# EAGLE design 7segement4digits1badidea-feathershield-mk-1.0 (EAGLE 7.5.0)
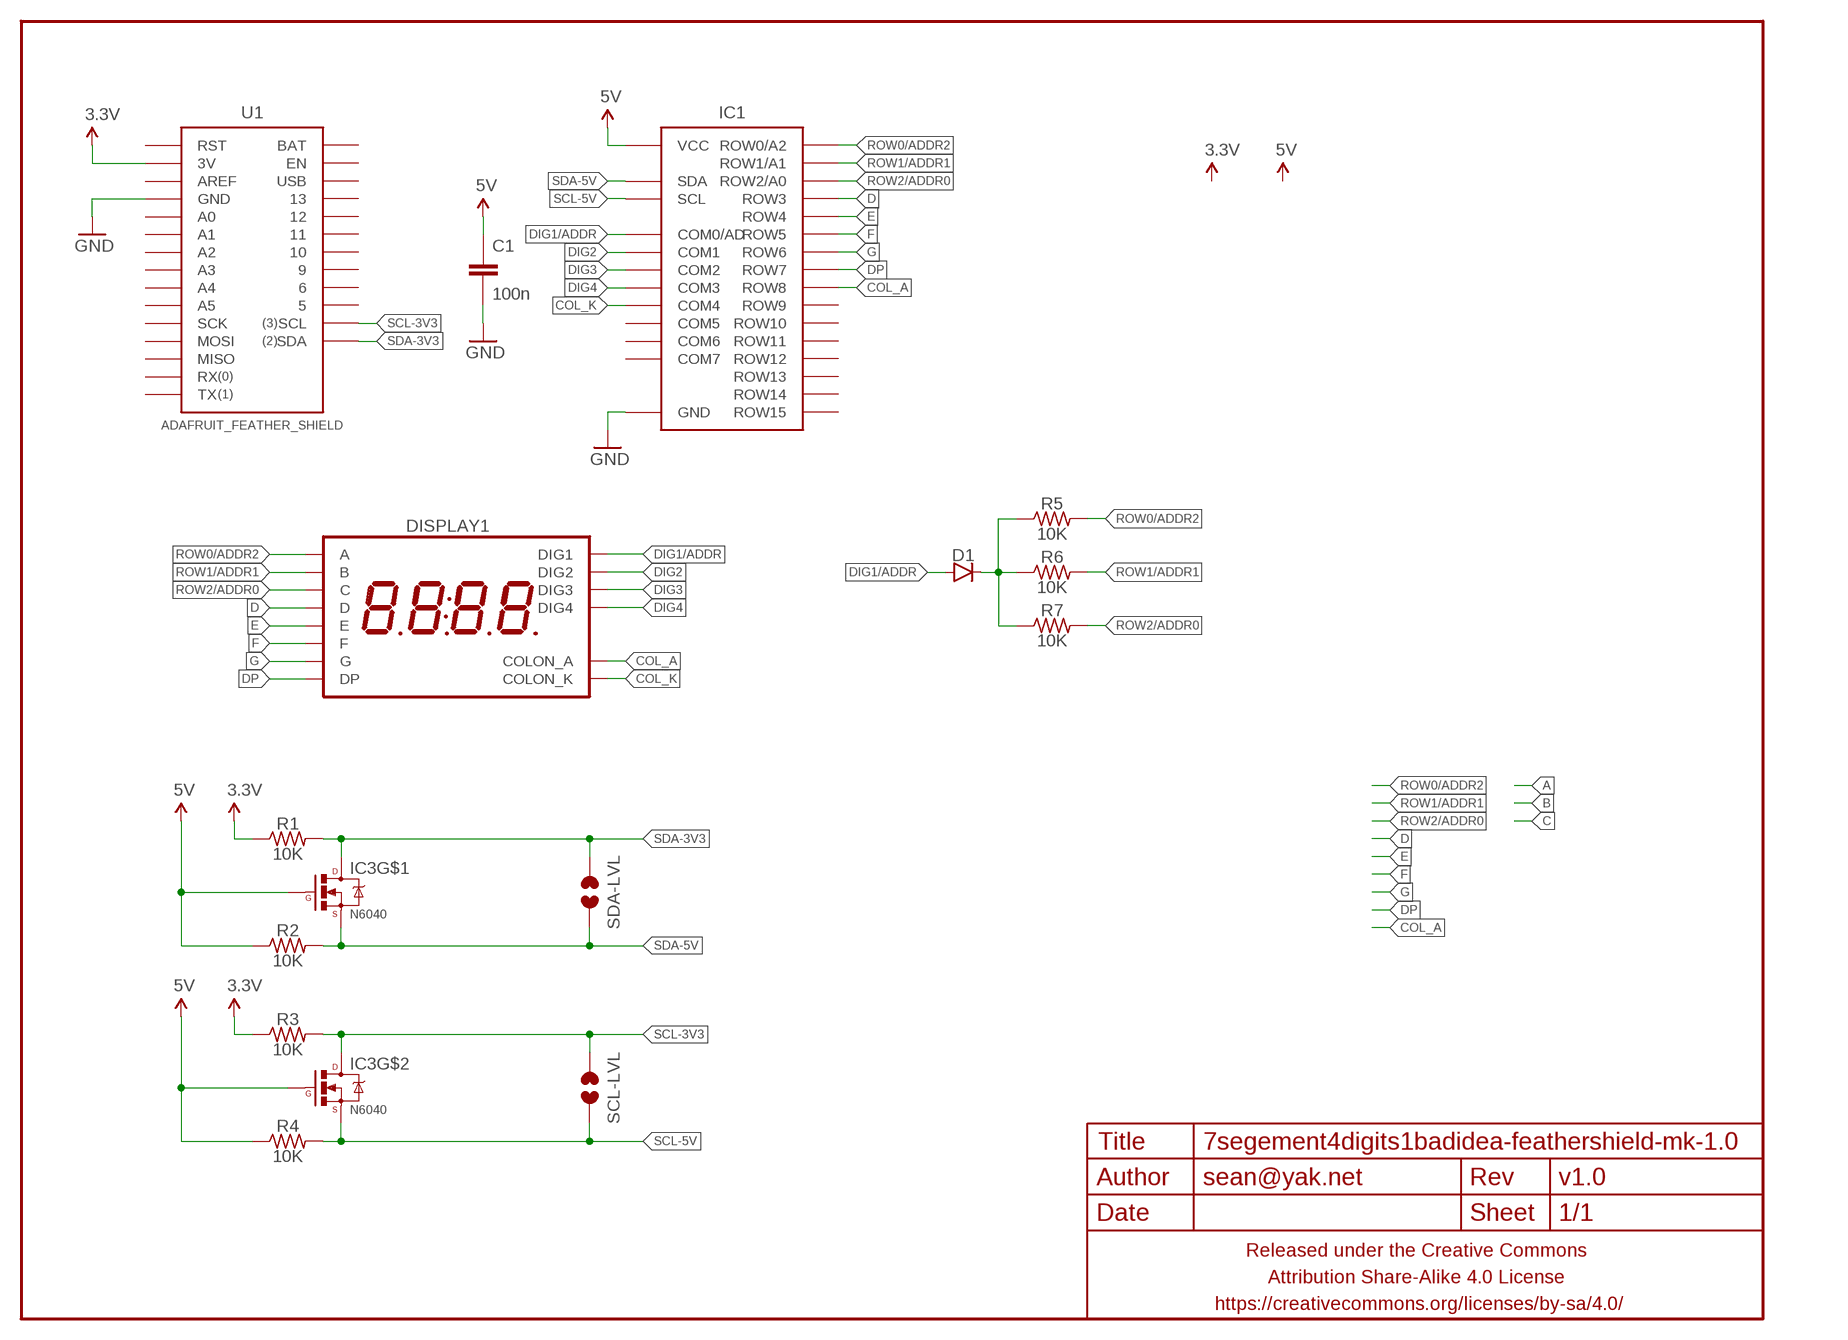
[diagram p0: schematic, sheet 1]

## Parts
C1  100n  CAPACITOR-CERAMICC0603  [C0603]
D1  DIODESOT23  [SOT23]
DISPLAY1  7SEG_4DIGIT_COLON14.2MM-CC  [7SEG_4DIG_0.56IN_14MM_ADAFRUIT]
FRAME1  FRAME-LETTERNO_PACKAGE  [DUMMY]
IC1  HT16K33  HT16K33-28SOIC28W  [SOIC28W]
IC3  N6040  MOSFET-NCHANNEL-DUALSOIC8  [SO08]
R1  10K  RESISTORR0603  [R0603]
R2  10K  RESISTORR0603  [R0603]
R3  10K  RESISTORR0603  [R0603]
R4  10K  RESISTORR0603  [R0603]
R5  10K  RESISTORR0603  [R0603]
R6  10K  RESISTORR0603  [R0603]
R7  10K  RESISTORR0603  [R0603]
SCL-LVL  JUMPER-PAD-2-NOYES_SILK  [PAD-JUMPER-2-NO_YES_SILK]
SDA-LVL  JUMPER-PAD-2-NOYES_SILK  [PAD-JUMPER-2-NO_YES_SILK]
U1  ADAFRUIT_FEATHER_SHIELD  [ADAFRUIT_FEATHER]

## Nets
3.3V: R1.1 R3.1 U1.3V
5V: C1.1 IC1.28(VCC) IC3.2(G) IC3.4(G) R2.1 R4.1
COL_A: DISPLAY1.P$8(COLON_A) IC1.17(ROW8)
COL_K: DISPLAY1.P$7(COLON_K) IC1.6(COM4)
D: DISPLAY1.P$2(D) IC1.22(ROW3)
DIG1/ADDR: D1.1(A) DISPLAY1.P$14(DIG1) IC1.2(COM0/AD)
DIG2: DISPLAY1.P$11(DIG2) IC1.3(COM1)
DIG3: DISPLAY1.P$10(DIG3) IC1.4(COM2)
DIG4: DISPLAY1.P$6(DIG4) IC1.5(COM3)
DP: DISPLAY1.P$3(DP) IC1.18(ROW7)
E: DISPLAY1.P$1(E) IC1.21(ROW4)
F: DISPLAY1.P$12(F) IC1.20(ROW5)
G: DISPLAY1.P$5(G) IC1.19(ROW6)
GND: C1.2 IC1.1(GND) U1.GND@0(GND) U1.GND@1(GND)
N$1: D1.3(C) R5.1 R6.1 R7.1
ROW0/ADDR2: DISPLAY1.P$13(A) IC1.25(ROW0/A2) R5.2
ROW1/ADDR1: DISPLAY1.P$9(B) IC1.24(ROW1/A1) R6.2
ROW2/ADDR0: DISPLAY1.P$4(C) IC1.23(ROW2/A0) R7.2
SCL-3V3: IC3.5(D) IC3.6(D) R3.2 SCL-LVL.1 U1.SCL
SCL-5V: IC1.26(SCL) IC3.3(S) R4.2 SCL-LVL.2
SDA-3V3: IC3.7(D) IC3.8(D) R1.2 SDA-LVL.1 U1.SDA
SDA-5V: IC1.27(SDA) IC3.1(S) R2.2 SDA-LVL.2
Unconnected: IC1.7(COM5) IC1.8(COM6) IC1.9(COM7) IC1.10(ROW15) IC1.11(ROW14) IC1.12(ROW13) IC1.13(ROW12) IC1.14(ROW11) IC1.15(ROW10) IC1.16(ROW9) U1.5 U1.6 U1.9 U1.10 U1.11 U1.12 U1.13 U1.A0 U1.A1 U1.A2 U1.A3 U1.A4 U1.A5 U1.AREF U1.BAT U1.EN U1.MISO U1.MOSI U1.RST U1.RX U1.SCK U1.TX U1.USB

## Library data of the parts
C1 = A_butts:CAPACITOR-CERAMIC: CAPACITOR, European symbol
D1 = a_parts:DIODE: Diode These are standard reverse protection diodes and small signal diodes. SMA package can handle up to about 1A. SOD-323 can handle about 200mA. What the SOD-323 package when ordering, there are some mfgs out there that are 5-pin packages.
DISPLAY1 = a_parts:7SEG_4DIGIT_COLON
FRAME1 = A_butts:FRAME-LETTER: Schematic Frame Standard 8.5x11 US Letter frame; DESIGNER: sean@yak.net; VERSION: v1.0
IC1 = a_parts:HT16K33-28
IC3 = a_parts:MOSFET-NCHANNEL-DUAL
R1-R7 = a_parts:RESISTOR: RESISTOR, American symbol
SCL-LVL SDA-LVL = a_parts:JUMPER-PAD-2-NO
U1 = a_parts:ADAFRUIT_FEATHER_SHIELD

## Board
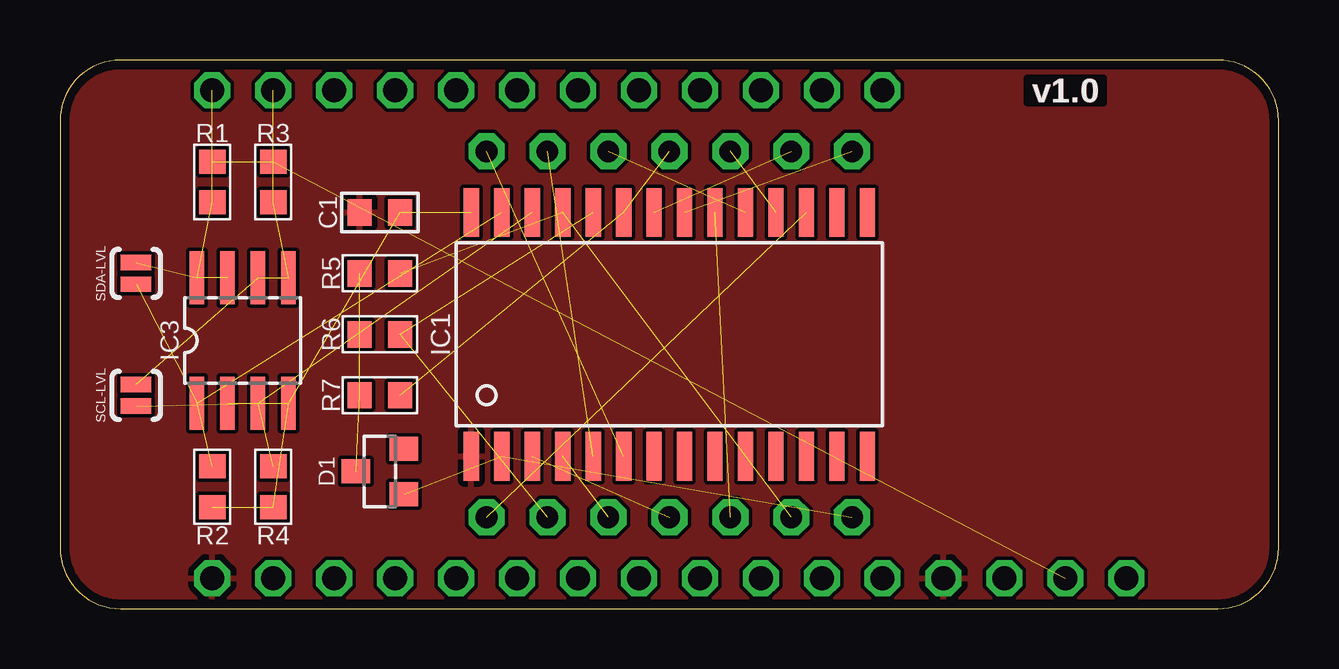
[diagram p1: board, top side]
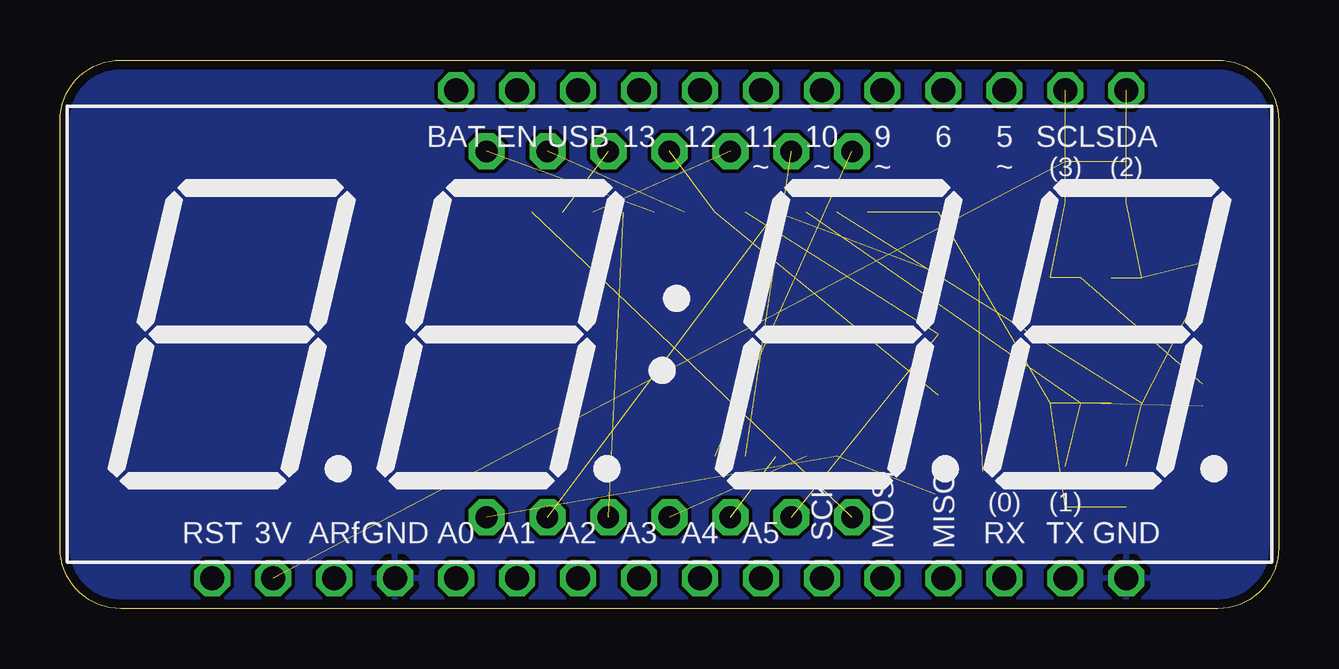
[diagram p2: board, bottom side, seen from below]

Size 50.8 x 22.86 mm. Coordinates in mm from the lower left corner, seen from the top.
Outline: 0,20.32 0,2.54 arc90 2.54,0 48.26,0 arc90 50.8,2.54 50.8,20.32 arc90 48.26,22.86 2.54,22.86 arc90 0,20.32
Copper layers (1*16): Top 0.0356mm / dielectric 1.5011mm / Bottom 0.0356mm
Design rules "LaenPCBOrder_2": minimum track width 6mil, minimum drill 13mil, track to track 6mil, track to pad 6mil, pad to pad 6mil, via to via 6mil, smd to smd 6mil, copper to edge 15mil, drill to drill 6mil, minimum pad ring 7mil, minimum via ring 7mil, stop-mask expansion 3mil, vias tented up to drill 20mil, thermal gap 10mil

### Footprints (pad centres in the part's own frame; a part is rotated, then mirrored left to right if it is on the bottom)
C0603 = smd 1 x 1.1: 1 -0.85,0; 2 0.85,0
SOT23 = smd 1 x 1.2: 1 -0.95,-1; 2 0.95,-1; 3 0,1
7SEG_4DIG_0.56IN_14MM_ADAFRUIT = drill 0.9 pad 1.5 octagon: P$1 -7.62,7.62; P$2 -5.08,7.62; P$3 -2.54,7.62; P$4 0,7.62; P$5 2.54,7.62; P$6 5.08,7.62; P$7 7.62,7.62; P$8 7.62,-7.62; P$9 5.08,-7.62; P$10 2.54,-7.62; P$11 0,-7.62; P$12 -2.54,-7.62; P$13 -5.08,-7.62; P$14 -7.62,-7.62
SOIC28W = smd 0.635 x 2.032: 1 -8.255,-5.08; 2 -6.985,-5.08; 3 -5.715,-5.08; 4 -4.445,-5.08; 5 -3.175,-5.08; 6 -1.905,-5.08; 7 -0.635,-5.08; 8 0.635,-5.08; 9 1.905,-5.08; 10 3.175,-5.08; 11 4.445,-5.08; 12 5.715,-5.08; 13 6.985,-5.08; 14 8.255,-5.08; 15 8.255,5.08; 16 6.985,5.08; 17 5.715,5.08; 18 4.445,5.08; 19 3.175,5.08; 20 1.905,5.08; 21 0.635,5.08; 22 -0.635,5.08; 23 -1.905,5.08; 24 -3.175,5.08; 25 -4.445,5.08; 26 -5.715,5.08; 27 -6.985,5.08; 28 -8.255,5.08
SO08 = smd 0.61 x 2.21: 1 -1.905,-2.616; 2 -0.635,-2.616; 3 0.635,-2.616; 4 1.905,-2.616; 5 1.905,2.616; 6 0.635,2.616; 7 -0.635,2.616; 8 -1.905,2.616
R0603 = smd 1 x 1.1: 1 -0.85,0; 2 0.85,0
PAD-JUMPER-2-NO_YES_SILK = smd 0.635 x 1.27: 1 -0.45,0; 2 0.45,0
ADAFRUIT_FEATHER = drill 1 pad 1.5 octagon: 3V -16.51,-10.16; 5 13.97,10.16; 6 11.43,10.16; 9 8.89,10.16; 10 6.35,10.16; 11 3.81,10.16; 12 1.27,10.16; 13 -1.27,10.16; A0 -8.89,-10.16; A1 -6.35,-10.16; A2 -3.81,-10.16; A3 -1.27,-10.16; A4 1.27,-10.16; A5 3.81,-10.16; AREF -13.97,-10.16; BAT -8.89,10.16; EN -6.35,10.16; GND@0 -11.43,-10.16; GND@1 19.05,-10.16; MISO 11.43,-10.16; MOSI 8.89,-10.16; RST -19.05,-10.16; RX 13.97,-10.16; SCK 6.35,-10.16; SCL 16.51,10.16; SDA 19.05,10.16; TX 16.51,-10.16; USB -3.81,10.16

### Placement (x,y rotation side)
C1  13.34,16.51 180 top
D1  13.34,5.71 90 top
DISPLAY1  25.4,11.43 0 bottom
FRAME1  0,-0.5 0 top
IC1  25.4,11.43 0 top
IC3  7.62,11.18 0 top
R1  6.35,17.78 270 top
R2  6.35,5.08 90 top
R3  8.89,17.78 270 top
R4  8.89,5.08 90 top
R5  13.34,13.97 0 top
R6  13.34,11.43 0 top
R7  13.34,8.89 0 top
SCL-LVL  3.17,8.89 270 top
SDA-LVL  3.17,13.97 270 top
U1  25.4,11.43 0 bottom

### Tracks (layer width: path | path; a pad name or v marks a point on that pad's centre or on a via)
3.3V  (2 unrouted)
5V  (5 unrouted)
COL_A  (1 unrouted)
COL_K  (1 unrouted)
D  (1 unrouted)
DIG1/ADDR  (2 unrouted)
DIG2  (1 unrouted)
DIG3  (1 unrouted)
DIG4  (1 unrouted)
DP  (1 unrouted)
E  (1 unrouted)
F  (1 unrouted)
G  (1 unrouted)
GND
  pour Top: 48.26,0 2.54,0 arc-90 0,2.54 0,20.32 arc-90 2.54,22.86 48.26,22.86 arc-90 50.8,20.32 50.8,2.54 arc-90
  pour Bottom: 50.8,20.32 50.8,2.54 arc-90 48.26,0 2.54,0 arc-90 0,2.54 0,20.32 arc-90 2.54,22.86 48.26,22.86 arc-90
N$1  (3 unrouted)
ROW0/ADDR2  (2 unrouted)
ROW1/ADDR1  (2 unrouted)
ROW2/ADDR0  (2 unrouted)
SCL-3V3  (4 unrouted)
SCL-5V  (3 unrouted)
SDA-3V3  (4 unrouted)
SDA-5V  (3 unrouted)